# Altium schematic sheet DischargeModule.SchDoc
size A3
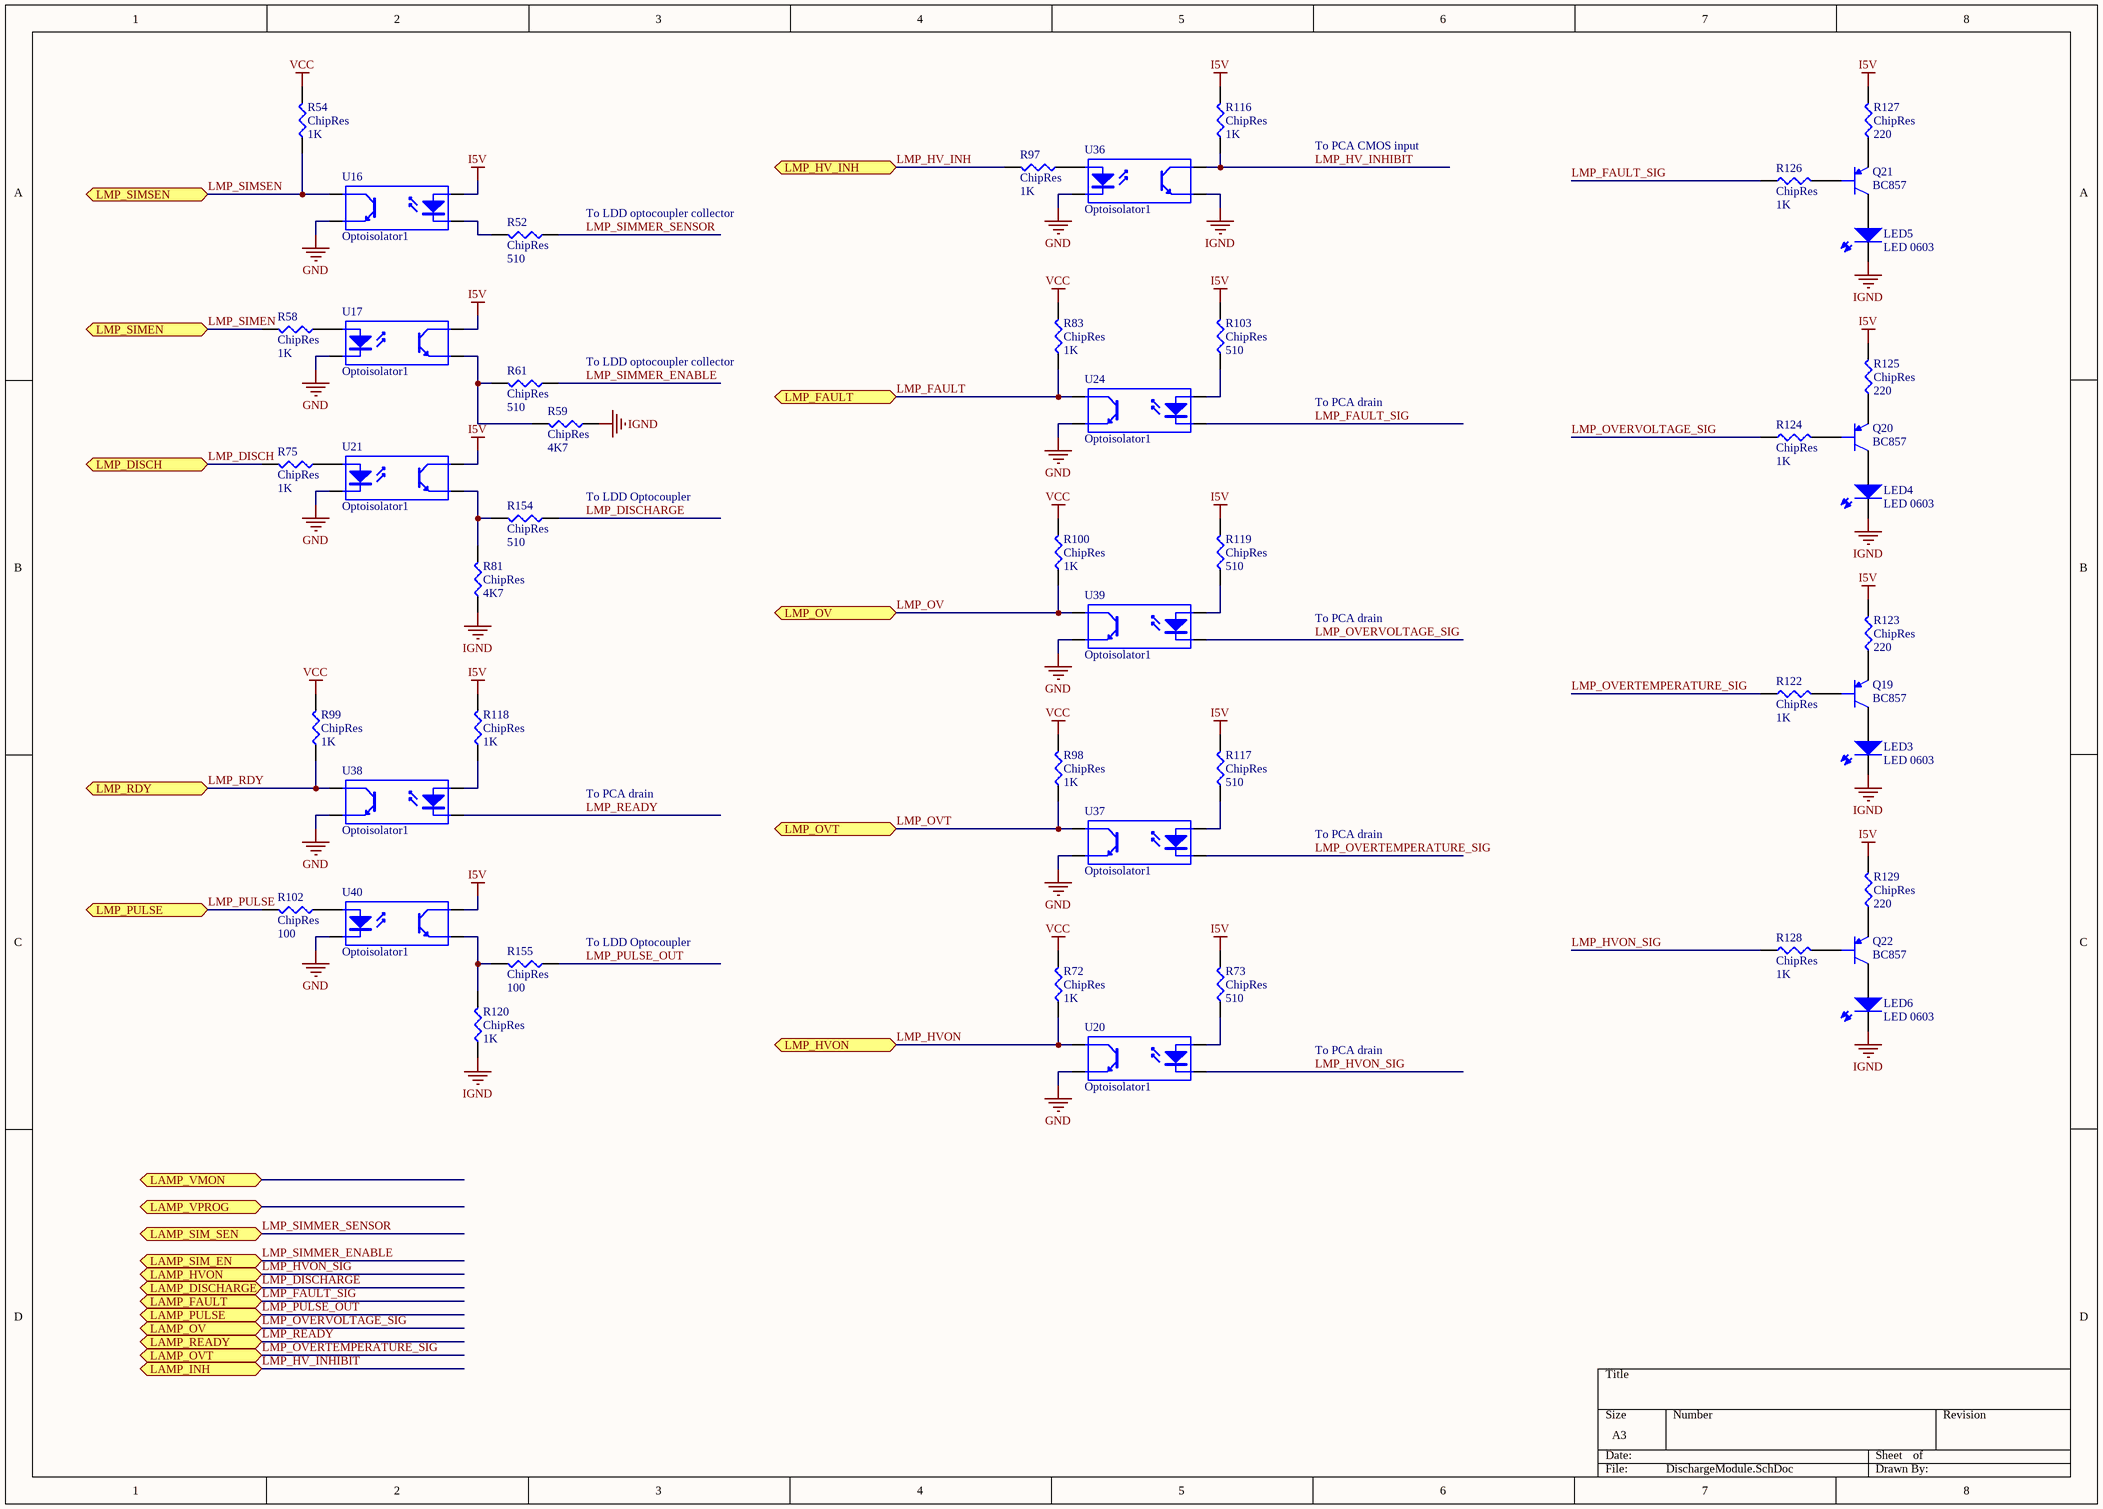
[diagram p0: DischargeModule.SchDoc]

## Parts
LED3  LED 0603  [PLCC-2]
LED4  LED 0603  [PLCC-2]
LED5  LED 0603  [PLCC-2]
LED6  LED 0603  [PLCC-2]
Q19  BC857  [SOT23]
Q20  BC857  [SOT23]
Q21  BC857  [SOT23]
Q22  BC857  [SOT23]
R52  ChipRes  value 510  [RES0805]
R54  ChipRes  value 1K  [RES0805]
R58  ChipRes  value 1K  [RES0805]
R59  ChipRes  value 4K7  [RES0805]
R61  ChipRes  value 510  [RES0805]
R72  ChipRes  value 1K  [RES0805]
R73  ChipRes  value 510  [RES0805]
R75  ChipRes  value 1K  [RES0805]
R81  ChipRes  value 4K7  [RES0805]
R83  ChipRes  value 1K  [RES0805]
R97  ChipRes  value 1K  [RES0805]
R98  ChipRes  value 1K  [RES0805]
R99  ChipRes  value 1K  [RES0805]
R100  ChipRes  value 1K  [RES0805]
R102  ChipRes  value 100  [RES0805]
R103  ChipRes  value 510  [RES0805]
R116  ChipRes  value 1K  [RES0805]
R117  ChipRes  value 510  [RES0805]
R118  ChipRes  value 1K  [RES0805]
R119  ChipRes  value 510  [RES0805]
R120  ChipRes  value 1K  [RES0805]
R122  ChipRes  value 1K  [RES0805]
R123  ChipRes  value 220  [RES0805]
R124  ChipRes  value 1K  [RES0805]
R125  ChipRes  value 220  [RES0805]
R126  ChipRes  value 1K  [RES0805]
R127  ChipRes  value 220  [RES0805]
R128  ChipRes  value 1K  [RES0805]
R129  ChipRes  value 220  [RES0805]
R154  ChipRes  value 510  [RES0805]
R155  ChipRes  value 100  [RES0805]
U16  Optoisolator1  [DIP-4]
U17  Optoisolator1  [DIP-4]
U20  Optoisolator1  [DIP-4]
U21  Optoisolator1  [DIP-4]
U24  Optoisolator1  [DIP-4]
U36  Optoisolator1  [DIP-4]
U37  Optoisolator1  [DIP-4]
U38  Optoisolator1  [DIP-4]
U39  Optoisolator1  [DIP-4]
U40  Optoisolator1  [DIP-4]

## Ports
LAMP_DISCHARGE, LAMP_FAULT, LAMP_HVON, LAMP_INH, LAMP_OV, LAMP_OVT, LAMP_PULSE, LAMP_READY, LAMP_SIM_EN, LAMP_SIM_SEN, LAMP_VMON, LAMP_VPROG, LMP_DISCH, LMP_FAULT, LMP_HV_INH, LMP_HVON, LMP_OV, LMP_OVT, LMP_PULSE, LMP_RDY, LMP_SIMEN, LMP_SIMSEN

## Nets
GND: U16.3(E) U17.2(K) U20.3(E) U21.2(K) U24.3(E) U36.2(K) U37.3(E) U38.3(E) U39.3(E) U40.2(K)
I5V: R73.2 R103.2 R116.2 R117.2 R118.2 R119.2 R123.2 R125.2 R127.2 R129.2 U16.1(A) U17.4(C) U21.4(C) U40.4(C)
IGND: LED3.1 LED4.1 LED5.1 LED6.1 R59.1 R81.1 R120.1 U36.3(E)
VCC: R54.2 R72.2 R83.2 R98.2 R99.2 R100.2
LMP_DISCH: R75.2 ; port LMP_DISCH
LMP_DISCHARGE: R154.1 ; port LAMP_DISCHARGE
LMP_FAULT: R83.1 U24.4(C) ; port LMP_FAULT
LMP_FAULT_SIG: R126.1 U24.2(K) ; port LAMP_FAULT
LMP_HV_INH: R97.2 ; port LMP_HV_INH
LMP_HV_INHIBIT: R116.1 U36.4(C) ; port LAMP_INH
LMP_HVON: R72.1 U20.4(C) ; port LMP_HVON
LMP_HVON_SIG: R128.1 U20.2(K) ; port LAMP_HVON
LMP_OV: R100.1 U39.4(C) ; port LMP_OV
LMP_OVERTEMPERATURE_SIG: R122.1 U37.2(K) ; port LAMP_OVT
LMP_OVERVOLTAGE_SIG: R124.1 U39.2(K) ; port LAMP_OV
LMP_OVT: R98.1 U37.4(C) ; port LMP_OVT
LMP_PULSE: R102.2 ; port LMP_PULSE
LMP_PULSE_OUT: R155.1 ; port LAMP_PULSE
LMP_RDY: R99.1 U38.4(C) ; port LMP_RDY
LMP_READY: U38.2(K) ; port LAMP_READY
LMP_SIMEN: R58.2 ; port LMP_SIMEN
LMP_SIMMER_ENABLE: R61.1 ; port LAMP_SIM_EN
LMP_SIMMER_SENSOR: R52.1 ; port LAMP_SIM_SEN
LMP_SIMSEN: R54.1 U16.4(C) ; port LMP_SIMSEN
NetLED3_2: LED3.2 Q19.3
NetLED4_2: LED4.2 Q20.3
NetLED5_2: LED5.2 Q21.3
NetLED6_2: LED6.2 Q22.3
NetQ19_1: Q19.1 R122.2
NetQ19_2: Q19.2 R123.1
NetQ20_1: Q20.1 R124.2
NetQ20_2: Q20.2 R125.1
NetQ21_1: Q21.1 R126.2
NetQ21_2: Q21.2 R127.1
NetQ22_1: Q22.1 R128.2
NetQ22_2: Q22.2 R129.1
NetR52_2: R52.2 U16.2(K)
NetR58_1: R58.1 U17.1(A)
NetR59_2: R59.2 R61.2 U17.3(E)
NetR73_1: R73.1 U20.1(A)
NetR75_1: R75.1 U21.1(A)
NetR81_2: R81.2 R154.2 U21.3(E)
NetR97_1: R97.1 U36.1(A)
NetR102_1: R102.1 U40.1(A)
NetR103_1: R103.1 U24.1(A)
NetR117_1: R117.1 U37.1(A)
NetR118_1: R118.1 U38.1(A)
NetR119_1: R119.1 U39.1(A)
NetR120_2: R120.2 R155.2 U40.3(E)

## Notes on the sheet
- To PCA CMOS input
- (near R52) To LDD optocoupler collector
- To LDD optocoupler collector
- To PCA drain
- To LDD Optocoupler
- (near R155) To LDD Optocoupler

## Library data of the parts
LED3-LED6 = LED0603
Q19-Q22 = BC857: PNP Transistor
R52 R54 R58 R59 R61 R72 R73 R75 R81 R83 R97-R100 R102 R103 R116-R120 R122-R129 R154 R155 = ChipRes: Chip resistor
U16 U17 U20 U21 U24 U36-U40 = Optoisolator1: 4-Pin Phototransistor Optocoupler; Published: 24-Mar-1999; LatestRevisionDate: 04-Mar-2005; LatestRevisionNote: Sch pins 3 & 4 Swapped.; DatasheetVersion: Nov-2003; PackageReference: DIP-4; Publisher: Altium Limited